# EAGLE schematic MagSwitch (EAGLE 7.3.0)
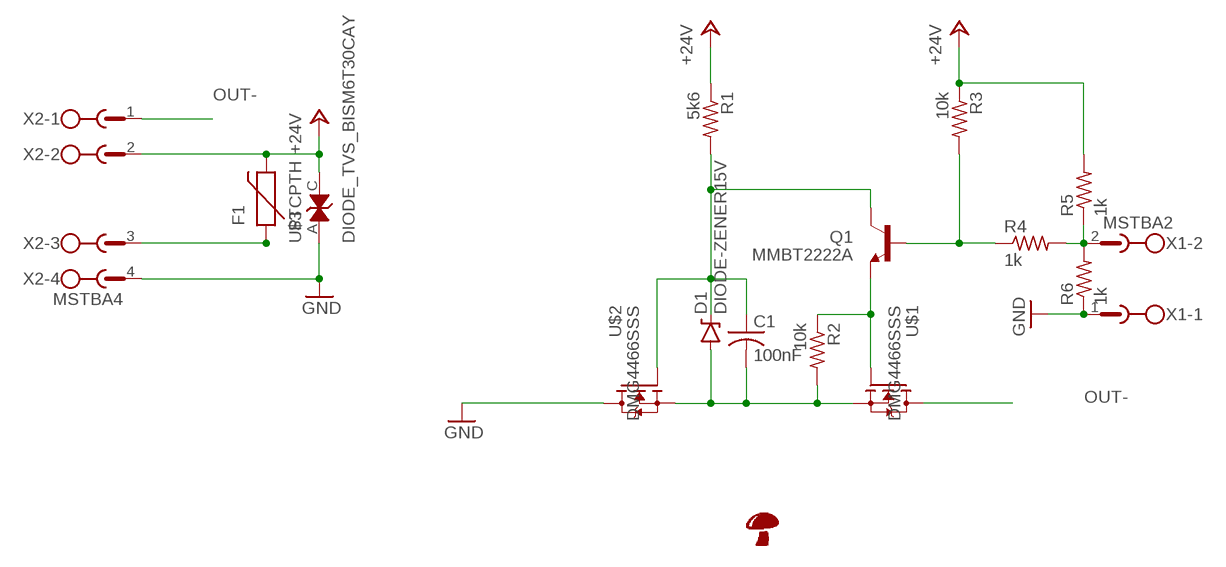
[diagram p0: schematic, sheet 1]

## Parts
C1  100nF  C-USC0805  [C0805]
D1  DIODE-ZENER15V  [SOD-323]
F1  PTCPTH  [PTC]
Q1  MMBT2222A  TRANSISTOR_NPNMMBT2222A  [SOT23-3]
R1  5k6  R-US_M0805  [M0805]
R2  10k  R-US_M0805  [M0805]
R3  10k  R-US_M0805  [M0805]
R4  1k  R-US_M0805  [M0805]
R5  1k  R-US_M0805  [M0805]
R6  1k  R-US_M0805  [M0805]
U$1  DMG4466SSS  [SO08]
U$2  DMG4466SSS  [SO08]
U$3  DIODE_TVS_BISM6T30CAY  [SMB-DIODE]
U$4  SHROOM5MM  [SHROOM]
X1  MSTBA2  [MSTBA2]
X2  MSTBA4  [MSTBA4]

## Nets
+24V: F1.P$2 R1.1 R3.1 R5.2 U$3.C X2.2
GND: R6.1 U$2.5(D) U$2.6(D) U$2.7(D) U$2.8(D) U$3.A X1.1 X2.4
N$1: R4.2 R5.1 R6.2 X1.2
N$2: Q1.1(B) R3.2 R4.1
N$3: C1.2 D1.A R2.2 U$1.1(S) U$1.2(S) U$1.3(S) U$2.1(S) U$2.2(S) U$2.3(S)
N$4: Q1.2(E) R2.1 U$1.4(G)
N$6: F1.P$1 X2.3
N$7: C1.1 D1.C Q1.3(C) R1.2 U$2.4(G)
OUT-: U$1.5(D) U$1.6(D) U$1.7(D) U$1.8(D) X2.1

## Library data of the parts
C1 = resistor:C-US: CAPACITOR, American symbol
D1 = RobThePyro:DIODE-ZENER: ON Semiconductor MM3Z15VST1G Zener Diode, 15V 300 mW SMT 2-Pin SOD-323 RS stock no.802-4568ManufacturerON Semiconductor Mfr. Part No.MM3Z15VST1G
F1 = SparkFun-PowerIC:PTC: Resettable Fuse PTC Resettable Fuse. Spark Fun Electronics SKU : COM-08357
Q1 = SparkFun-DiscreteSemi:TRANSISTOR_NPN: Generic NPN BJT MMBT2222A - TRANS-08049 (SOT-23, 1A 40V) MPSA42 - TRANS-09116 (SOT-23, 500mA 300V) MMBT5088LT1G - TRANS-11160 (SOT-23, 50 mA 30V) BC547 - COM-08928 <http://www.sparkfun.com/products/8928> (TO-92 45V 100mA) (1.Collector 2.Base 3.Emitter) 2N3904 - COM-00521 <http://www.sparkfun.com/products/521> (TO-92 40V 200mA) (1.Emitter 2.Base 3.Collector) P2N2222A - COM-12852 <http://www.sparkfun.com/products/12852> (TO-92 40V 600mA) (1.Collector 2.Base 3.Emitter); PROD_ID: TRANS-08049
R1-R6 = resistor:R-US_: RESISTOR, American symbol
U$1 U$2 = RobThePyro:DMG4466SSS
U$3 = RobThePyro:DIODE_TVS_BI: STMicroelectronics SM6T30CAY Bi-Directional TVS Diode, 600W peak, 2-Pin DO-214AA RS stock no. 795-8877 Brand STMicroelectronics Mfr. Part No. SM6T30CAY
U$4 = RobThePyro:SHROOM
X1 = con-phoenix-508:MSTBA2: PHOENIX; MF: FARNELL; MPN: 1757242; OC_FARNELL: 3705171; OC_NEWARK: 71C4161
X2 = con-phoenix-508:MSTBA4: PHOENIX; MF: FARNELL; MPN: 1757268; OC_FARNELL: 3705195; OC_NEWARK: 71C4163